# Altium schematic sheet IR_INPUT_POWER.SchDoc: IR_INPUT_POWER
size 420 x 297 mm; SHEET: 2; OF: 8; Engineer: ALPER KORKMAZ; SheetNumber: 2; SheetTotal: 8
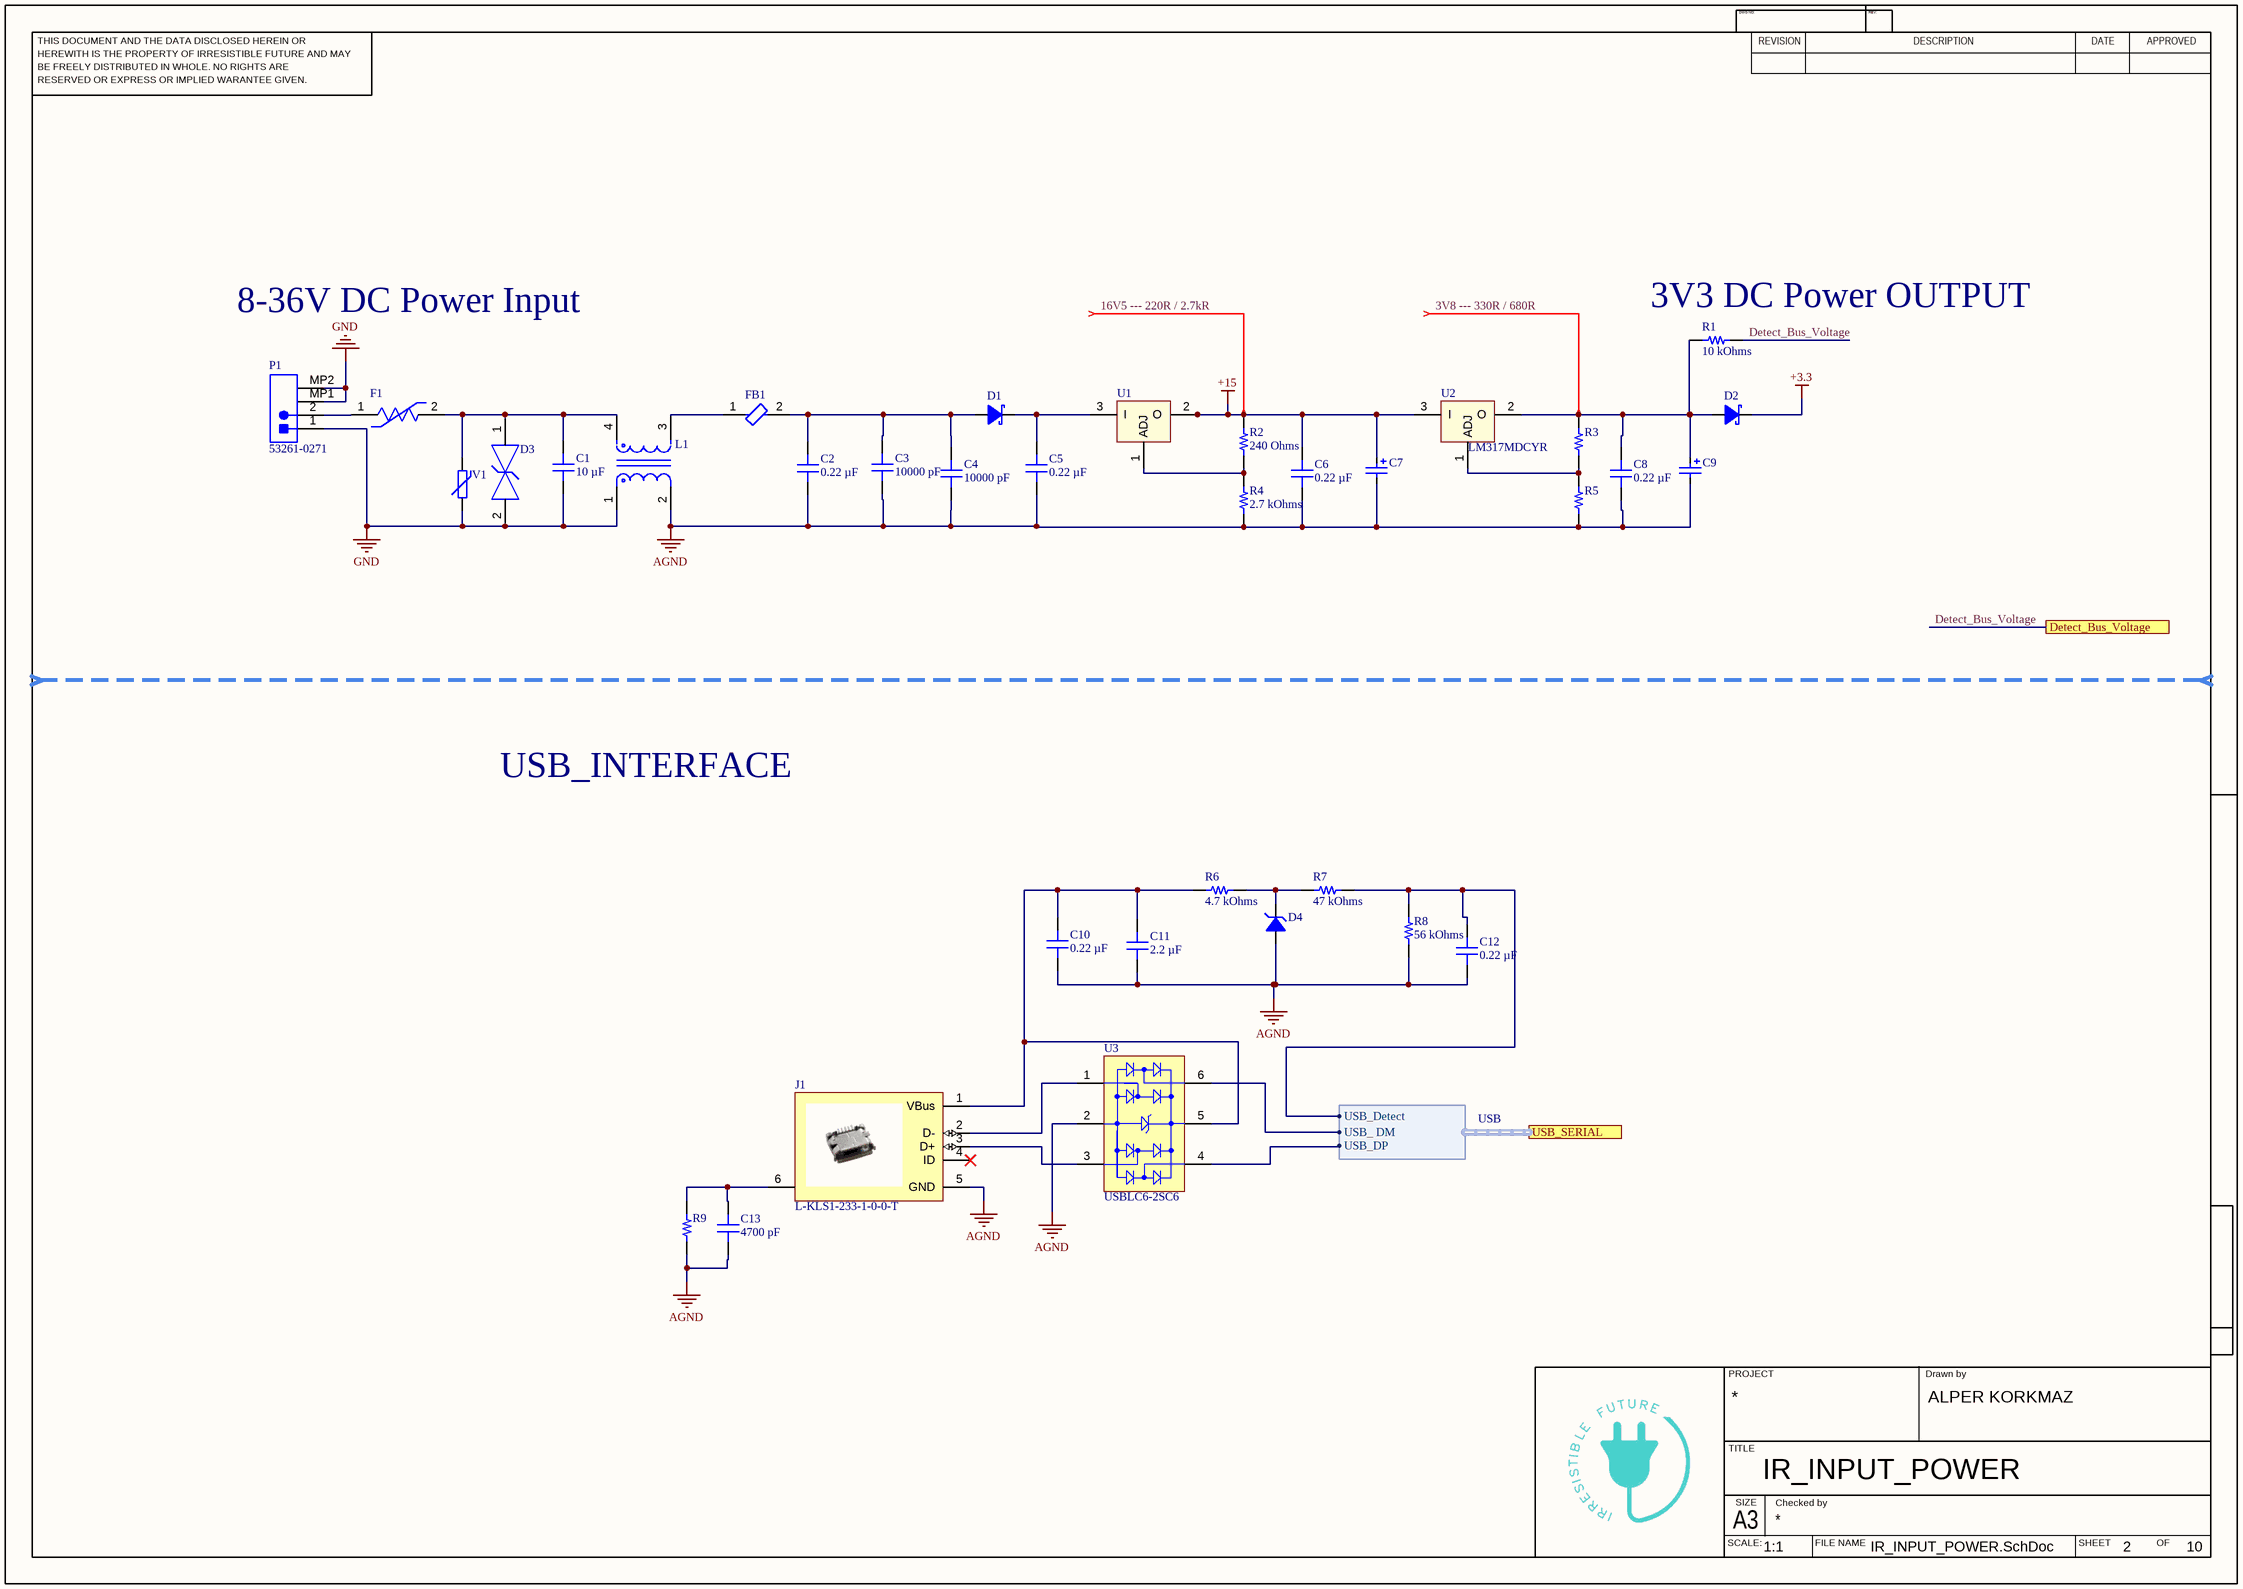
[diagram p0: IR_INPUT_POWER.SchDoc]

## Parts
C1  10 µF  [CAP 1206_3216 - 0.8MM]
C2  0.22 µF  [CAP 0805_2012]
C3  10000 pF  [CAP 0805_2012]
C4  10000 pF  [CAP 0805_2012]
C5  0.22 µF  [CAP 0805_2012]
C6  0.22 µF  [CAP 0805_2012]
C7  EEE-1VA101XP  [AE_C_R6]  (value not drawn)
C8  0.22 µF  [CAP 0805_2012]
C9  EEE-1VA101XP  [AE_C_R6]  (value not drawn)
C10  0.22 µF  [CAP 0805_2012]
C11  2.2 µF  [CAP 0805_2012]
C12  0.22 µF  [CAP 0805_2012]
C13  4700 pF  [CAP 0805_2012]
D1  PMEG6020ELRX  [SOD123W]  (value not drawn)
D2  PMEG6020ELRX  [SOD123W]  (value not drawn)
D3  SMAJ5.0CA-TR  [FP-SMA-MFG]  (value not drawn)
D4  BZT52C5V6-HE3-08  [SOD123]  (value not drawn)
F1  1812L075/33DR  [FP-1812L075-33DR-MFG]  (value not drawn)
FB1  BLM21PG220SN1D  [FP-BLM21-0_2-t0_85-e0_5-MFG]  (value not drawn)
J1  L-KLS1-233-1-0-0-T  [USB_MICRO_1981584-1]
L1  DLW5BTM101SQ2L  [FP-DLW5BT-MFG]  (value not drawn)
P1  53261-0271  [MOLX-53261-0271_V]
R1  10 kOhms  [RES 0603_1608]
R2  240 Ohms  [RES 0603_1608]
R3  330 Ohms  [RES 0603_1608]  (value not drawn)
R4  2.7 kOhms  [RES 0603_1608]
R5  680 Ohms  [RES 0603_1608]  (value not drawn)
R6  4.7 kOhms  [RES 0603_1608]
R7  47 kOhms  [RES 0603_1608]
R8  56 kOhms  [RES 0603_1608]
R9  1 MOhms  [RES 0603_1608]  (value not drawn)
U1  LM317MDCYR  [SOT-223-4]  (value not drawn)
U2  LM317MDCYR  [SOT-223-4]
U3  USBLC6-2SC6  [STM-SOT23-6L_V]
V1  82541250  [V-1206]  (value not drawn)

## Ports
Detect_Bus_Voltage (see 1[1B], 3[4A]), USB_SERIAL (harness USB, see 1[1B], 3[2C])

## Harnesses
USB: USB_Detect, USB_ DM, USB_DP

## Nets
+3.3: D2.1(K)
+15: C6.2 C7.1 R2.2 U1.2(O) U2.3(I)
AGND: C2.1 C3.1 C4.1 C5.1 C6.1 C7.2 C8.1 C9.2 C10.1 C11.1 C12.1 C13.1 D4.1(T1) J1.5(GND) L1.2 R4.1 R5.1 R8.1 R9.1 U3.2(GND)
GND: C1.1 D3.2 L1.1 P1.1 P1.MP1 P1.MP2 V1.1
Detect_Bus_Voltage: R1.2 ; port Detect_Bus_Voltage
NetC1_2: C1.2 D3.1 F1.2 L1.4 V1.2
NetC2_2: C2.2 C3.2 C4.2 D1.2(A) FB1.2
NetC5_2: C5.2 D1.1(K) U1.3(I)
NetC8_2: C8.2 C9.1 D2.2(A) R1.1 R3.2 U2.2(O)
NetC10_2: C10.2 C11.2 J1.1(VBus) R6.1 U3.5(VBUS)
NetC12_2: C12.2 R7.2 R8.2 ; port USB_SERIAL.USB_Detect
NetC13_2: C13.2 J1.6(Shield) R9.2
NetD4_2: D4.2(T2) R6.2 R7.1
NetF1_1: F1.1 P1.2
NetFB1_1: FB1.1 L1.3
NetJ1_2: J1.2(D-) U3.1(I/O_1)
NetJ1_3: J1.3(D+) U3.3(I/O_2)
NetR2_1: R2.1 R4.2 U1.1(ADJ)
NetR3_1: R3.1 R5.2 U2.1(ADJ)
NetU3_4: U3.4(I/O_3) ; port USB_SERIAL.USB_DP
NetU3_6: U3.6(I/O_4) ; port USB_SERIAL.USB_ DM

Not connected (* = marked no-connect by the designer): J1 4(ID)*

## Notes on the sheet
- 8-36V DC Power Input
- 16V5 --- 220R / 2.7kR
- 3V8 --- 330R / 680R
- (near R1) 3V3 DC Power OUTPUT
- USB_INTERFACE
- THIS DOCUMENT AND THE DATA DISCLOSED HEREIN OR
- HEREWITH IS THE PROPERTY OF IRRESISTIBLE FUTURE AND MAY
- DWG NO:
- REVISION
- REV:
- DESCRIPTION
- DATE
- APPROVED
- BE FREELY DISTRIBUTED IN WHOLE. NO RIGHTS ARE
- RESERVED OR EXPRESS OR IMPLIED WARANTEE GIVEN.
- PROJECT
- Drawn by
- TITLE
- SCALE:
- A3
- SIZE
- Checked by
- FILE NAME
- SHEET
- OF
- 1:1
- 10

## Library data of the parts
C1 = EMK316BJ106MD-T: CAP CER 10UF 16V X5R 1206; manufacturer: Taiyo Yuden; Tolerance: ±20%; Part Number: EMK316BJ106MD-T; Value: 10 µF; Applications: SMPS Filtering; Capacitance: 10 µF; componentlink1description: Datasheet; componentlink1url: http://www.yuden.co.jp/productdata/catalog/mlcc06_e.pdf; componentlink2description: DigiKey Link; componentlink2url: https://www.digikey.com/en/products/detail/taiyo-yuden/EMK316BJ106MD-T/6563474; Device Package: 1206 (3216 Metric); lastupdated: 11.07.2022 14:49:38; Lifecycle Status: Active; Minimum Order: 1; Mounting Type: Surface Mount, MLCC; Operating Temperature: -55°C ~ 85°C; Package / Case: 1206 (3216 Metric); packaging: TapeAndReel; partid: 18996; Part Status: Active; price: 0.07; series: M; Size / Dimension: 0.126" L x 0.063" W (3.20mm x 1.60mm); Supplier 1: DigiKey; Supplier Part Number 1: 587-4881-1-ND; Temperature Coefficient: X5R; Thickness (Max): 0.037" (0.95mm); Voltage - Rated: 16V
C2 C5 C6 C8 C10 C12 = HMJ212BB7224KGHT: CAP CER 0.22UF 100V X7R 0805; manufacturer: Taiyo Yuden; Tolerance: ±10%; Part Number: HMJ212BB7224KGHT; Value: 0.22 µF; Applications: Automotive, Boardflex Sensitive; Capacitance: 0.22 µF; componentlink1description: Datasheet; componentlink1url: https://www.yuden.co.jp/productdata/catalog//mlcc11_hq_e.pdf; componentlink2description: DigiKey Link; componentlink2url: https://www.digikey.com/en/products/detail/taiyo-yuden/HMJ212BB7224KGHT/5214817; Device Package: 0805 (2012 Metric); Features: Soft Termination; lastupdated: 11.07.2022 14:47:11; Lifecycle Status: Active; Minimum Order: 1; Mounting Type: Surface Mount, MLCC; Operating Temperature: -55°C ~ 125°C; Package / Case: 0805 (2012 Metric); packaging: TapeAndReel; partid: 3008; Part Status: Active; price: 0.10; Ratings: AEC-Q200; series: M; Size / Dimension: 0.079" L x 0.049" W (2.00mm x 1.25mm); Supplier 1: DigiKey; Supplier Part Number 1: 587-4221-1-ND; Temperature Coefficient: X7R; Thickness (Max): 0.053" (1.35mm); Voltage - Rated: 100V
C3 = C0805X103K1RAC3316: CAP CER 0805 10NF 100V X7R; manufacturer: KEMET; Tolerance: ±10%; Part Number: C0805X103K1RAC3316; Value: 10000 pF; Applications: Automotive, Boardflex Sensitive; Capacitance: 10000 pF; componentlink1description: Datasheet; componentlink1url: https://api.kemet.com/component-edge/download/datasheet/C0805X103K1RAC3316.pdf; componentlink2description: DigiKey Link; componentlink2url: https://www.digikey.com/en/products/detail/kemet/C0805X103K1RAC3316/10315780; Device Package: 0805 (2012 Metric); Features: Soft Termination; lastupdated: 11.07.2022 14:47:12; Lifecycle Status: Active; Minimum Order: 1; Mounting Type: Surface Mount, MLCC; Operating Temperature: -55°C ~ 125°C; Package / Case: 0805 (2012 Metric); packaging: TapeAndReel; partid: 2565; Part Status: Active; price: 0.02; Ratings: AEC-Q200; series: SMD Auto X7R VW80808; Size / Dimension: 0.079" L x 0.049" W (2.00mm x 1.25mm); Supplier 1: DigiKey; Supplier Part Number 1: 399-C0805X103K1RAC3316CT-ND; Temperature Coefficient: X7R; Thickness (Max): 0.039" (0.98mm); Voltage - Rated: 100V
C4 = C0805C103J5RAC7210: CAP CER SMD 0805 .01UF X7R 5% 50; manufacturer: KEMET; Voltage - Rated: 50V; Part Number: C0805C103J5RAC7210; Value: 10000 pF; Applications: Bypass, Decoupling; Capacitance: 10000 pF; componentlink1description: Datasheet; componentlink1url: https://api.kemet.com/component-edge/download/datasheet/C0805C103J5RAC7210.pdf; componentlink2description: DigiKey Link; componentlink2url: https://www.digikey.com/en/products/detail/kemet/C0805C103J5RAC7210/8572451; Device Package: 0805 (2012 Metric); lastupdated: 11.07.2022 14:47:04; Lifecycle Status: Active; Minimum Order: 1; Mounting Type: Surface Mount, MLCC; Operating Temperature: -55°C ~ 125°C; Package / Case: 0805 (2012 Metric); packaging: TapeAndReel; partid: 5768; Part Status: Active; price: 0.01; series: SMD Comm X7R; Size / Dimension: 0.079" L x 0.049" W (2.00mm x 1.25mm); Supplier 1: DigiKey; Supplier Part Number 1: 399-17616-1-ND; Temperature Coefficient: X7R; Thickness (Max): 0.035" (0.88mm); Tolerance: ±5%
C7 C9 = Capacitor_(Electrolytic)__EEE-1VA101XP: CAP ALUM 100UF 20% 35V SMD; Manufacturer: Panasonic Electronic Components; Capacitance: 100µF; Ripple Current: 132mA @ 120Hz; Polarization: Polar; Lifetime @ Temp.: 2000 Hrs @ 85°C; Surface Mount Land Size: 0.260" L x 0.260" W (6.60mm x 6.60mm); Package / Case: Radial, Can - SMD; Mounting Type: Surface Mount; Manufacturer Part Number: EEE-1VA101XP; Voltage Rating: 35V; Operating Temperature: -40°C ~ 85°C; Packaging: Tape & Reel (TR); Height - Seated (Max): 0.303" (7.70mm); Supplier: Digi-Key; Applications: General Purpose; RoHS: RoHS Compliant; Tolerance: ±20%; Impedance: -; Lead Spacing: -; Size / Dimension: 0.248" Dia (6.30mm); ESR (Equivalent Series Resistance): -; Category: Capacitors; Part Status: Active; ComponentLink1URL: https://industrial.panasonic.com/cdbs/www-data/pdf/RDE0000/ABA0000C1145.pdf; ComponentLink1Description: https://industrial.panasonic.com/cdbs/www-data/pdf/RDE0000/ABA0000C1145.pdf; Pricing: 900=0.1006, 1800=0.09557, 2700=0.09054, 4500=0.08551, 9000=0.08048, 22500=0.07796, 45000=0.07545, 90000=0.07042 (USD); Stock: 45900; Supplier Part Number: PCE3951TR-ND
C11 = CL21A225KB9LNNC: CAP CER 2.2UF 50V X5R 0805; manufacturer: Samsung Electro-Mechanics; Tolerance: ±10%; Part Number: CL21A225KB9LNNC; Value: 2.2 µF; Applications: General Purpose; Capacitance: 2.2 µF; componentlink1description: Datasheet; componentlink1url: http://www.samsungsem.com/kr/support/product-search/mlcc/CL21A225KB9LNNC.jsp; componentlink2description: DigiKey Link; componentlink2url: https://www.digikey.com/en/products/detail/samsung-electro-mechanics/CL21A225KB9LNNC/3888067; Device Package: 0805 (2012 Metric); Features: Low Profile; lastupdated: 11.07.2022 14:47:11; Lifecycle Status: Active; Minimum Order: 1; Mounting Type: Surface Mount, MLCC; Operating Temperature: -55°C ~ 85°C; Package / Case: 0805 (2012 Metric); packaging: TapeAndReel; partid: 3097; Part Status: Active; price: 0.05; series: CL; Size / Dimension: 0.079" L x 0.049" W (2.00mm x 1.25mm); Supplier 1: DigiKey; Supplier Part Number 1: 1276-2409-1-ND; Temperature Coefficient: X5R; Thickness (Max): 0.039" (1.00mm); Voltage - Rated: 50V
C13 = C0805C472K5RACAUTO: CAP CER 4700PF 50V X7R 0805; manufacturer: KEMET; Tolerance: ±10%; Part Number: C0805C472K5RACAUTO; Value: 4700 pF; Applications: Automotive, Bypass, Decoupling; Capacitance: 4700 pF; componentlink1description: Datasheet; componentlink1url: https://api.kemet.com/component-edge/download/datasheet/C0805C472K5RACAUTO.pdf; componentlink2description: DigiKey Link; componentlink2url: https://www.digikey.com/en/products/detail/kemet/C0805C472K5RACAUTO/3314962; Device Package: 0805 (2012 Metric); lastupdated: 11.07.2022 14:47:12; Lifecycle Status: Active; Minimum Order: 1; Mounting Type: Surface Mount, MLCC; Operating Temperature: -55°C ~ 125°C; Package / Case: 0805 (2012 Metric); packaging: TapeAndReel; partid: 2514; Part Status: Active; price: 0.01; Ratings: AEC-Q200; series: SMD Auto X7R; Size / Dimension: 0.079" L x 0.049" W (2.00mm x 1.25mm); Supplier 1: DigiKey; Supplier Part Number 1: 399-6969-1-ND; Temperature Coefficient: X7R; Thickness (Max): 0.035" (0.88mm); Voltage - Rated: 50V
D1 D2 = DIODE_PMEG6020ELRX: DIODE SCHOTTKY 60V 2A CFP3; Manufacturer: Nexperia; Supplier 1: Avnet; Manufacturer Part Number: PMEG6020ELRX; Stock 1: 0; Pricing 1: 12000=0.0781, 18000=0.0762, 30000=0.0747, 60000=0.0732, 120000=0.0711, 600000=0.0691, 1200000=0.0671 (USD); RoHS Compliant: Yes; ComponentLink1URL: https://assets.nexperia.com/documents/data-sheet/PMEG6020ELR.pdf?src-supplier=Digi-Key; ComponentLink1Description: https://assets.nexperia.com/documents/data-sheet/PMEG6020ELR.pdf?src-supplier=Digi-Key; ComponentLink2URL: http://www.farnell.com/datasheets/2168440.pdf?src-supplier=Farnell; ComponentLink2Description: http://www.farnell.com/datasheets/2168440.pdf?src-supplier=Farnell; ComponentLink3URL: http://www.farnell.com/datasheets/2168440.pdf?src-supplier=Newark; ComponentLink3Description: http://www.farnell.com/datasheets/2168440.pdf?src-supplier=Newark; Supplier Part Number 1: PMEG6020ELRX
D3 = CMP-12225-000029-1: TVS DIODE 5V 13.4V SMA; Manufacturer: STMicroelectronics; Peak Pulse Power: 400W; Breakdown Voltage: 6.4V; Number Of Channels: 1; Clamping Voltage: 9.2V; Standoff Height: 0.05mm; Peak Pulse Current: 43.5A; Max Junction Temp: +150°C; Direction: Bidirectional; Height: 2.65mm; ComponentLink2Description: Datasheet; ComponentLink2URL: https://www.st.com/resource/en/datasheet/smaj.pdf; Temperature: -55°C to +150°C; Temperature Range High: +150°C; Digikey Description: TVS DIODE 5V 13.4V SMA; Device Class L1: Circuit Protection; Package: SMA; Octopart: https://octopart.com/smaj5.0ca-tr-stmicroelectronics-350177; Mouser Description: TVS Diodes - Transient Voltage Suppressors 400W 5.0V Bidirect; Temperature Range Low: -55°C; Category: Diode; Device Class L3: unset; Device Class L2: TVS Diodes; Lead Free: Yes; Automotive: No; Reverse Standoff Voltage: 5V; Manufacturer Part Number: SMAJ5.0CA-TR; RoHS: TRUE
D4 = DIODE_BZT52C5V6-HE3-08: DIODE ZENER 5.6V 410MW SOD123; Manufacturer: Vishay; Voltage Tolerance: 5%; Zener Current: 59mA; Power Dissipation: 500mW; Max Reverse Leakage Current: 100nA; Impedance: 10R; Element Configuration: Single; Supplier 1: Avnet; Manufacturer Part Number: BZT52C5V6-HE3-08; Stock 1: 0; Pricing 1: 3000=0.0519, 6000=0.0449, 12000=0.0447, 18000=0.0378, 24000=0.0376, 30000=0.0352, 300000=0.0328 (USD); Mount: Surface Mount; Number of Pins: 2; Min Operating Temperature: -55°C; Max Operating Temperature: 150°C; Packaging: Tape and Reel; Package Quantity: 3000; Zener Voltage: 5.6V; Max Power Dissipation: 410mW; Tolerance: 5%; ComponentLink1URL: http://www.mouser.com/ds/2/427/bzt52-106265.pdf?src-supplier=Mouser; ComponentLink1Description: http://www.mouser.com/ds/2/427/bzt52-106265.pdf?src-supplier=Mouser; Supplier Part Number 1: BZT52C5V6-HE3-08
F1 = CMP-08606-000075-1: PTC RESET FUSE 33V 750MA 1812; Power Dissipation: 800mW; Time to Trip: 200ms; Approvals: TUV; Max Current Rating: 20A; Trip Current: 1.5A; Resistance: 400mR; Working Voltage: 33V; Min Operating Temperature: -40°C; Terminal Material: Copper; Case/Package: 1812; Case Code (Imperial): 1812; Termination: SMD/SMT; Lead Free: Lead Free; Mount: Surface Mount; Case Code (Metric): 4532; Package Quantity: 1500; Packaging: Tape and Reel; Voltage Rating: 33V; Operating Supply Voltage: 33V; Hold Current: 750mA; Height: 1.55mm; Width: 3.41mm; Series: 1812L; Length: 4.73mm; Max Power Dissipation: 800mW; Current Rating: 20A; Max Operating Temperature: 85°C; REACH SVHC: No SVHC; RoHS Compliant: Yes; Voltage Rating (DC): 33V
FB1 = CMP-0686-00622-4: Chip Ferrite Bead, 0805, 22Ω @ 100MHz, 0.009Ω, 25%, 6A; Manufacturer Series: BLM21P; Resistance: 10mR; DC Resistance-Max: 9mR; Material: Steel; Number of Circuits: 1; Impedance: 22R; Shielding: Unshielded; DC Current: 6A; Termination: SMD/SMT; Max Operating Temperature: 125°C; Case Code (Metric): 2012; Radiation Hardening: No; Length: 2mm; Case Code (Imperial): 0805; RoHS Compliant: Yes; Max Current Rating: 6A; DC Resistance (DCR): 9mR; Case/Package: 0805; Core Material: Ferrite; Width: 1.25mm; Weight: 0.000194oz; Number of Pins: 2; Packaging: Tape and Reel; REACH SVHC: No SVHC; Tolerance: 25%; Height: 0.85mm; Number of Functions: 1; Lead Free: Lead Free; Terminal Finish: Tin; Number of Lines: 1; Package Quantity: 1; Series: BLM21P; Test Frequency: 100MHz; Min Operating Temperature: -55°C; Max DC Current: 6A; Current Rating: 6A; Depth: 1.25mm
J1 = USB_Micro_L-KLS1-233-1-0-0-T: Conn Micro USB 2.0 Type AB RCP 5 POS 0.65mm Solder RA SMD 5 Terminal 1 Port T/R; Manufacturer: KLS Electronic; ComponentLink1Description: Datasheet; ComponentLink1URL: https://cdn.ozdisan.com/ETicaret_Dosya/480449_6645382.pdf; Supplier Part Number 1: https://www.ozdisan.com/connectors-and-interconnects/usb-dvi-hdmi-connectors/usb-connectors/L-KLS1-233-1-0-0-T; Manufacturer Part Number: L-KLS1-233-1-0-0-T; Supplier 2: Digi-Key; RoHS: Yes; Category: Audio / Video Connectors; Stock 2: 25591; Pricing 2: 1=1,71000, 10=1,55200, 25=1,45720, 50=1,39380, 100=1,33050, 250=1,20380, 500=1,10876 (USD); ComponentLink2URL: https://www.te.com/commerce/DocumentDelivery/DDEController?Action=srchrtrv&amp;DocNm=1981584&amp;DocType=Customer+Drawing&amp;DocLang=English&src-supplier=Digi-Key; ComponentLink2Description: https://www.te.com/commerce/DocumentDelivery/DDEController?Action=srchrtrv&amp;DocNm=1981584&amp;DocType=Customer+Drawing&amp;DocLang=English&src-supplier=Digi-Key; Ozdisan: L-KLS1-233-1-0-0-T; Supplier Part Number 2: A97799CT-ND
L1 = CMP-06045-000680-1: Common Mode Choke, 2020, 100Ω @ 100MHz, 0.013Ω, 6A; Voltage Rating (DC): 50V; Shielding: Unshielded; Number of Lines: 2; Impedance: 100R; DC Resistance (DCR): 13mR; Tolerance: 40%; Termination: SMD/SMT; Height: 0.098inch; Packaging: Tape and Reel; Resistor Type: Wirewound; Max Operating Temperature: 85°C; RoHS Compliant: Yes; Case/Package: 2020; Mount: Surface Mount; Max Current Rating: 6A; Min Operating Temperature: -40°C; Width: 0.197inch; Test Frequency: 100MHz; Package Quantity: 700; Lead Free: Lead Free; Weight: 0.010582oz; Series: DLW5B; Length: 0.197inch; Max DC Current: 6A
P1 = CMP-2000-05633-1: PicoBlade(TM) Header, Right Angle, -40 to 85 degC, 2-Pin SMD, RoHS, Tape and Reel; Current - Max: 1A; Brand: Molex; Voltage Rating: 125V; Number of Positions: 2; Pitch: 1.25mm; Package Version: Rev. H, 11/2014; Factory Pack Quantity: 1000; Datasheet URL: http://www.molex.com/webdocs/datasheets/pdf/en-us/0532610271_PCB_HEADERS.pdf; Datasheet Version: 03/2016; Housing Material: Thermoplastic; RoHS: Details; Product Type: Headers; Number of Rows: 1; Termination Style: SMD; Mounting Technology: SurfaceMount; Number of Positions / Contacts: 2; Package URL: http://www.molex.com/pdm_docs/sd/532610271_sd.pdf; Mounting Angle: Right; Mounting Style: SMD/SMT; Manufacturer: Molex; Product Category: 1.25mmConnectors; Tradename: PicoBlade; Voltage - Max: 125V; Manufacturer URL: http://www.molex.com/; Series: 53261; Package Description: 2-Leads Header, Pitch 1.25 mm, Mated Height 3.4 mm; Package Reference: 53261-0271; Current Rating: 1A; Contact Plating: Tin; Contact Material: PhosphorBronze; Type: Shrouded; Packaging: Reel
R1 = RNCS0603BKE10K0: RES 10K OHM 0.1% 1/16W 0603; Manufacturer: Stackpole Electronics Inc; Power (Watts): 0.063W, 1/16W; Temperature Coefficient: ±25ppm/°C; Part Number: RNCS0603BKE10K0; Value: 10 kOhms; ComponentLink1Description: Datasheet; ComponentLink1URL: https://www.seielect.com/catalog/sei-rncs_rnch.pdf; ComponentLink2Description: DigiKey Link; ComponentLink2URL: https://www.digikey.com/en/products/detail/stackpole-electronics-inc/RNCS0603BKE10K0/1708836; Composition: Thin Film; Device Package: 0603 (1608 Metric); Features: Anti-Corrosive, Automotive AEC-Q200, Moisture Resistant; Height - Seated (Max): 0.022" (0.55mm); LastUpdated: 11.07.2022 15:05:17; Lifecycle Status: Active; Minimum Order: 1; Number of Terminations: 2; Operating Temperature: -55°C ~ 155°C; Package / Case: 0603 (1608 Metric); Packaging: TapeAndReel; PartId: 4838; Part Status: Active; Price: 0.08; Ratings: AEC-Q200; Resistance: 10 kOhms; Series: RNCS; Size / Dimension: 0.061" L x 0.031" W (1.55mm x 0.80mm); Supplier 1: DigiKey; Supplier Part Number 1: RNCS0603BKE10K0CT-ND; Supplier Device Package: 0603; Tolerance: ±0.1%
R2 = ESR03EZPJ240: RES SMD 240 OHM 5% 1/4W 0603; Manufacturer: Rohm Semiconductor; Power (Watts): 0.25W, 1/4W; Temperature Coefficient: ±200ppm/°C; Part Number: ESR03EZPJ240; Value: 240 Ohms; ComponentLink1Description: Datasheet; ComponentLink1URL: https://www.rohm.com/datasheet/ESR01MZPF/esr-e; ComponentLink2Description: DigiKey Link; ComponentLink2URL: http://digikey.com/product-detail/en/rohm-semiconductor/ESR03EZPJ240/RHM24DCT-ND/4053749; Composition: Thick Film; Device Package: 0603 (1608 Metric); Features: Automotive AEC-Q200, Pulse Withstanding; Height - Seated (Max): 0.022" (0.55mm); LastUpdated: 11.07.2022 15:05:16; Lifecycle Status: Active; Minimum Order: 1; Number of Terminations: 2; Operating Temperature: -55°C ~ 155°C; Package / Case: 0603 (1608 Metric); Packaging: TapeAndReel; PartId: 5228; Part Status: Active; Price: 0.01; Ratings: AEC-Q200; Resistance: 240 Ohms; Series: ESR; Size / Dimension: 0.063" L x 0.031" W (1.60mm x 0.80mm); Supplier 1: DigiKey; Supplier Part Number 1: RHM24DCT-ND; Supplier Device Package: 0603; Tolerance: ±5%
R3 = CRGH0603F330R: RES SMD 330 OHM 1% 1/5W 0603; Manufacturer: TE Connectivity Passive Product; Power (Watts): 0.2W, 1/5W; Temperature Coefficient: ±100ppm/°C; Part Number: CRGH0603F330R; Value: 330 Ohms; ComponentLink1Description: Datasheet; ComponentLink1URL: https://www.te.com/commerce/DocumentDelivery/DDEController?Action=srchrtrv&DocNm=1773204-1&DocType=DS&DocLang=English; ComponentLink2Description: DigiKey Link; ComponentLink2URL: https://www.digikey.com/en/products/detail/te-connectivity-passive-product/CRGH0603F330R/5586961; Composition: Thick Film; Device Package: 0603 (1608 Metric); Height - Seated (Max): 0.022" (0.55mm); LastUpdated: 11.07.2022 15:05:14; Lifecycle Status: Active; Minimum Order: 1; Number of Terminations: 2; Operating Temperature: -55°C ~ 155°C; Package / Case: 0603 (1608 Metric); Packaging: TapeAndReel; PartId: 5733; Part Status: Active; Price: 0.01; Resistance: 330 Ohms; Series: CRGH, Neohm; Size / Dimension: 0.063" L x 0.031" W (1.60mm x 0.80mm); Supplier 1: DigiKey; Supplier Part Number 1: A129541CT-ND; Supplier Device Package: 0603; Tolerance: ±1%
R4 = CRGP0603F2K7: RES 2.7K OHM 1% 1/4W 0603; Manufacturer: TE Connectivity Passive Product; Power (Watts): 0.25W, 1/4W; Temperature Coefficient: ±100ppm/°C; Part Number: CRGP0603F2K7; Value: 2.7 kOhms; ComponentLink1Description: Datasheet; ComponentLink1URL: https://www.te.com/commerce/DocumentDelivery/DDEController?Action=srchrtrv&DocNm=9-1773463-9&DocType=DS&DocLang=English; ComponentLink2Description: DigiKey Link; ComponentLink2URL: https://www.digikey.com/en/products/detail/te-connectivity-passive-product/CRGP0603F2K7/8577023; Composition: Thick Film; Device Package: 0603 (1608 Metric); Features: Pulse Withstanding; Height - Seated (Max): 0.022" (0.55mm); LastUpdated: 11.07.2022 15:05:17; Lifecycle Status: Active; Minimum Order: 1; Number of Terminations: 2; Operating Temperature: -55°C ~ 155°C; Package / Case: 0603 (1608 Metric); Packaging: TapeAndReel; PartId: 5002; Part Status: Active; Price: 0.02; Resistance: 2.7 kOhms; Series: CRGP; Size / Dimension: 0.063" L x 0.031" W (1.60mm x 0.80mm); Supplier 1: DigiKey; Supplier Part Number 1: A130421CT-ND; Supplier Device Package: 0603; Tolerance: ±1%
R5 = KTR03EZPF6800: RES SMD 680 OHM 1% 1/10W 0603; Manufacturer: Rohm Semiconductor; Power (Watts): 0.1W, 1/10W; Temperature Coefficient: ±100ppm/°C; Part Number: KTR03EZPF6800; Value: 680 Ohms; ComponentLink1Description: Datasheet; ComponentLink1URL: https://www.rohm.com/datasheet/KTR03EZPF/ktr-e; ComponentLink2Description: DigiKey Link; ComponentLink2URL: https://www.digikey.com/en/products/detail/rohm-semiconductor/KTR03EZPF6800/4051681; Composition: Thick Film; Device Package: 0603 (1608 Metric); Features: Automotive AEC-Q200, High Voltage; Height - Seated (Max): 0.022" (0.55mm); LastUpdated: 11.07.2022 15:05:15; Lifecycle Status: Active; Minimum Order: 1; Number of Terminations: 2; Operating Temperature: -55°C ~ 155°C; Package / Case: 0603 (1608 Metric); Packaging: TapeAndReel; PartId: 5438; Part Status: Active; Price: 0.02; Ratings: AEC-Q200; Resistance: 680 Ohms; Series: KTR; Size / Dimension: 0.063" L x 0.031" W (1.60mm x 0.80mm); Supplier 1: DigiKey; Supplier Part Number 1: RHM680AYCT-ND; Supplier Device Package: 0603; Tolerance: ±1%
R6 = ERA-3AEB472V: RES SMD 4.7K OHM 0.1% 1/10W 0603; Manufacturer: Panasonic Electronic Components; Power (Watts): 0.1W, 1/10W; Temperature Coefficient: ±25ppm/°C; Part Number: ERA-3AEB472V; Value: 4.7 kOhms; ComponentLink1Description: Datasheet; ComponentLink1URL: https://industrial.panasonic.com/cdbs/www-data/pdf/RDM0000/AOA0000C307.pdf; ComponentLink2Description: DigiKey Link; ComponentLink2URL: http://digikey.com/product-detail/en/panasonic-electronic-components/ERA-3AEB472V/P4.7KDBCT-ND/1466068; Composition: Thin Film; Device Package: 0603 (1608 Metric); Features: Automotive AEC-Q200; Height - Seated (Max): 0.022" (0.55mm); LastUpdated: 11.07.2022 15:05:15; Lifecycle Status: Active; Minimum Order: 1; Number of Terminations: 2; Operating Temperature: -55°C ~ 155°C; Package / Case: 0603 (1608 Metric); Packaging: TapeAndReel; PartId: 5519; Part Status: Active; Price: 0.04; Ratings: AEC-Q200; Resistance: 4.7 kOhms; Series: ERA-3A; Size / Dimension: 0.063" L x 0.031" W (1.60mm x 0.80mm); Supplier 1: DigiKey; Supplier Part Number 1: P4.7KDBCT-ND; Supplier Device Package: 0603; Tolerance: ±0.1%
R7 = RCS060347K0JNEA: RES SMD 47K OHM 5% 1/4W 0603; Manufacturer: Vishay Dale; Power (Watts): 0.25W, 1/4W; Temperature Coefficient: ±200ppm/°C; Part Number: RCS060347K0JNEA; Value: 47 kOhms; ComponentLink1Description: Datasheet; ComponentLink1URL: http://www.vishay.com/docs/20065/rcse3.pdf; ComponentLink2Description: DigiKey Link; ComponentLink2URL: https://www.digikey.com/en/products/detail/vishay-dale/RCS060347K0JNEA/5866965; Composition: Thick Film; Device Package: 0603 (1608 Metric); Features: Automotive AEC-Q200, Pulse Withstanding; Height - Seated (Max): 0.020" (0.50mm); LastUpdated: 11.07.2022 15:05:15; Lifecycle Status: Active; Minimum Order: 1; Number of Terminations: 2; Operating Temperature: -55°C ~ 155°C; Package / Case: 0603 (1608 Metric); Packaging: TapeAndReel; PartId: 5445; Part Status: Active; Price: 0.02; Ratings: AEC-Q200; Resistance: 47 kOhms; Series: RCS e3; Size / Dimension: 0.061" L x 0.033" W (1.55mm x 0.85mm); Supplier 1: DigiKey; Supplier Part Number 1: 541-2819-1-ND; Supplier Device Package: 0603; Tolerance: ±5%
R8 = RT0603BRD0756KL: RES SMD 56K OHM 0.1% 1/10W 0603; Manufacturer: Yageo; Power (Watts): 0.1W, 1/10W; Temperature Coefficient: ±25ppm/°C; Part Number: RT0603BRD0756KL; Value: 56 kOhms; ComponentLink1Description: Datasheet; ComponentLink1URL: https://www.yageo.com/upload/media/product/productsearch/datasheet/rchip/PYu-RT_1-to-0.01_RoHS_L_11.pdf; ComponentLink2Description: DigiKey Link; ComponentLink2URL: https://www.digikey.com/en/products/detail/yageo/RT0603BRD0756KL/1072582; Composition: Thin Film; Device Package: 0603 (1608 Metric); Height - Seated (Max): 0.022" (0.55mm); LastUpdated: 11.07.2022 15:05:04; Lifecycle Status: Active; Minimum Order: 1; Number of Terminations: 2; Operating Temperature: -55°C ~ 155°C; Package / Case: 0603 (1608 Metric); Packaging: TapeAndReel; PartId: 9254; Part Status: Active; Price: 0.04; Resistance: 56 kOhms; Series: RT; Size / Dimension: 0.063" L x 0.031" W (1.60mm x 0.80mm); Supplier 1: DigiKey; Supplier Part Number 1: YAG4576CT-ND; Supplier Device Package: 0603; Tolerance: ±0.1%
R9 = RT0603BRD071ML: RES SMD 1M OHM 0.1% 1/10W 0603; Manufacturer: Yageo; Power (Watts): 0.1W, 1/10W; Temperature Coefficient: ±25ppm/°C; Part Number: RT0603BRD071ML; Value: 1 MOhms; ComponentLink1Description: Datasheet; ComponentLink1URL: https://www.yageo.com/upload/media/product/productsearch/datasheet/rchip/PYu-RT_1-to-0.01_RoHS_L_11.pdf; ComponentLink2Description: DigiKey Link; ComponentLink2URL: http://digikey.com/product-detail/en/yageo/RT0603BRD071ML/YAG4498CT-ND/6616654; Composition: Thin Film; Device Package: 0603 (1608 Metric); Height - Seated (Max): 0.022" (0.55mm); LastUpdated: 11.07.2022 15:05:15; Lifecycle Status: Active; Minimum Order: 1; Number of Terminations: 2; Operating Temperature: -55°C ~ 155°C; Package / Case: 0603 (1608 Metric); Packaging: TapeAndReel; PartId: 5503; Part Status: Active; Price: 0.03; Resistance: 1 MOhms; Series: RT; Size / Dimension: 0.063" L x 0.031" W (1.60mm x 0.80mm); Supplier 1: DigiKey; Supplier Part Number 1: YAG4498CT-ND; Supplier Device Package: 0603; Tolerance: ±0.1%
U1 U2 = LM317MDCY: IC REG LINEAR ADJ 0.5A SOT223; Manufacturer: Texas Instruments; Regulator Topology: Positive Adjustable; Current - Output: 500mA; Voltage - Output: 1.25 V ~ 37 V; Voltage - Input: 4.2 V ~ 40 V; Packaging: Tape & Reel (TR); Manufacturer Part Number: LM317MDCYR; Supplier: Digi-Key; Part Status: Active; RoHS: RoHS Compliant; Supplier Device Package: SOT-223-4; Package / Case: TO-261-4, TO-261AA; Voltage - Dropout (Typical): -; Mounting Type: Surface Mount; Current - Limit (Min): -; Operating Temperature: 0°C ~ 125°C; Category: Integrated Circuits (ICs); ComponentLink1URL: http://www.ti.com/lit/ds/symlink/lm317m.pdf; ComponentLink1Description: http://www.ti.com/lit/ds/symlink/lm317m.pdf; Pricing: 2500=0.319, 5000=0.297, 12500=0.286 (USD); Supplier Part Number: 296-12631-2-ND
U3 = CMP-2000-05378-1: Very low capacitance ESD protection, 3.5 pF, -40 to 125 degC, 6-Pin SOT23, RoHS, Tape and Reel; Manufacturer: STMicroelectronics; Polarity: Uni-Directional; Clamping Voltage: 17V; Rad Hardened: No; Product Height (mm): 1.3mm; Leakage Current (Max): 0.15uA; Product Length (mm): 3.05mm; Number of Elements: 1; Peak Pulse Current: 5A; Configuration: Dual; Reverse Breakdown Voltage: 6V; Working Voltage (Max): 5V; Capacitance Value: 3.5pF; Suppressor Type: DiodeArrays; Product Depth (mm): 1.75mm; Test Current (It): 1mA; Package / Case: SOT-23; Operating Temperature Max Deg. C: 125C; Package Description: 6-Pin Small Outline Transistor, Body 2.925 x 1.625 mm, Pitch 0.95 mm; Package Reference: SOT23-6L; Datasheet Version: Rev. 5, 10/2011; Operating Temperature Min Deg. C: -40C; Mounting Style: SurfaceMount; Direction Type: Uni-Directional; Mounting: SurfaceMount; Pin Count: 6; Leakage Current: 0.15uA; Packaging: TapeandReel; Operating Temperature Classification: Automotive; Clamping Voltage (Max): 17V; Manufacturer URL: http://www.st.com/; Reverse Stand-off Voltage: 5V; Datasheet URL: http://www.st.com/st-web-ui/static/active/en/resource/technical/document/datasheet/CD00050750.pdf; Working Voltage: 5V; Operating Temp Range: -40Cto125C
V1 = VARISTOR_82541250: VARISTOR 39V 200A 1206; Manufacturer: Wurth Electronics Inc.; Number of Circuits: 1; Maximum AC Volts: 25VAC; Capacitance @ Frequency: 620pF @ 1kHz; Maximum DC Volts: 30VDC; Energy: 1.0J; Varistor Voltage (Min): 35.88V; Varistor Voltage (Max): 42.12V; Operating Temperature: -40°C ~ 125°C (TA); Packaging: Tape & Reel (TR); Category: Circuit Protection; Part Status: Active; RoHS: RoHS Compliant; Package / Case: 1206 (3216 Metric); Varistor Voltage (Typ): 39V; Mounting Type: Surface Mount, MLCV; Supplier: Digi-Key; Manufacturer Part Number: 82541250; ComponentLink1URL: http://katalog.we-online.de/pbs/datasheet/82541250.pdf; ComponentLink1Description: http://katalog.we-online.de/pbs/datasheet/82541250.pdf; Pricing: 3000=0.564 (USD); Supplier Part Number: 732-2553-2-ND